# EAGLE design temperature_sensor (EAGLE 9.1.2)
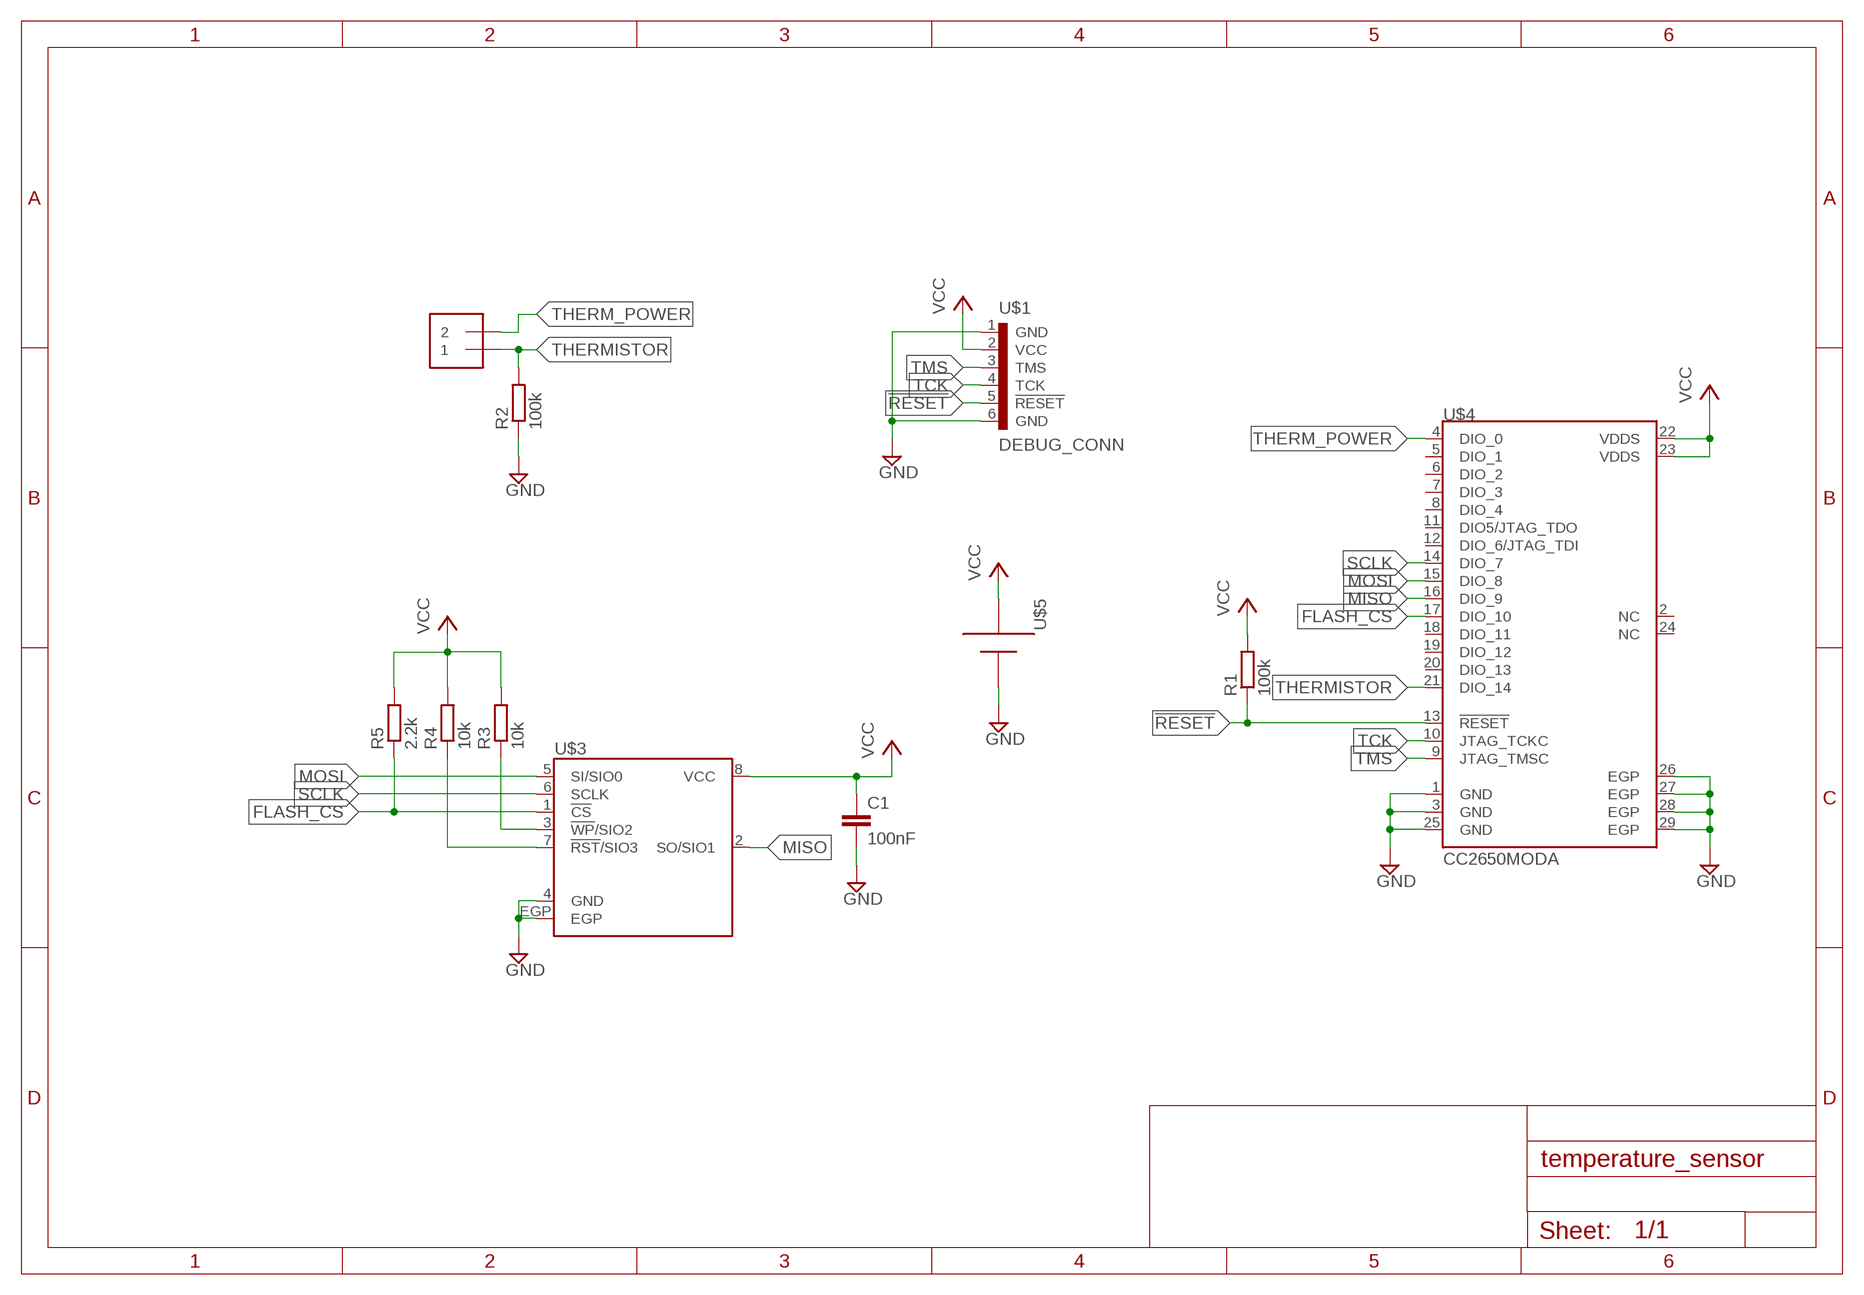
[diagram p0: schematic, sheet 1]

## Parts
C1  100nF  CAPACITOR_0402  [0402]
J2  1X2-3.5MM  [1X2-3.5MM]
R1  100k  RESISTOR_0402  [0402]
R2  100k  RESISTOR_0402  [0402]
R3  10k  RESISTOR_0402  [0402]
R4  10k  RESISTOR_0402  [0402]
R5  2.2k  RESISTOR_0402  [0402]
U$1  DEBUG_CONN  [DEBUG_CONN]
U$3  MX25R8035FMX25R8035FZUIL0  [MX25R8035FZUIL0]
U$4  CC2650MODA  [CC2650MODA]
U$5  CR2_SPRINGS  [CR2]

## Nets
!RESET: R1.1 U$1.5(!RESET) U$4.13(!RESET)
FLASH_CS: R5.1 U$3.1(!CS) U$4.17(DIO_10)
GND: C1.2 R2.1 U$1.1(GND) U$1.6(GND) U$3.4(GND) U$3.EGP U$4.1(GND) U$4.3(GND) U$4.25(GND) U$4.26(EGP) U$4.27(EGP) U$4.28(EGP) U$4.29(EGP) U$5.- U$5.-@1(-) U$5.-@2(-) U$5.-@3(-)
MISO: U$3.2(SO/SIO1) U$4.16(DIO_9)
MOSI: U$3.5(SI/SIO0) U$4.15(DIO_8)
N$1: R3.1 U$3.3(!WP!/SIO2)
N$2: R4.1 U$3.7(!RST!/SIO3)
SCLK: U$3.6(SCLK) U$4.14(DIO_7)
TCK: U$1.4(TCK) U$4.10(JTAG_TCKC)
THERM_POWER: J2.2 U$4.4(DIO_0)
THERMISTOR: J2.1 R2.2 U$4.21(DIO_14)
TMS: U$1.3(TMS) U$4.9(JTAG_TMSC)
VCC: C1.1 R1.2 R3.2 R4.2 R5.2 U$1.2(VCC) U$3.8(VCC) U$4.22(VDDS) U$4.23(VDDS) U$5.+ U$5.+@1(+) U$5.+@2(+) U$5.+@3(+)
Unconnected: U$4.2(NC) U$4.5(DIO_1) U$4.6(DIO_2) U$4.7(DIO_3) U$4.8(DIO_4) U$4.11(DIO5/JTAG_TDO) U$4.12(DIO_6/JTAG_TDI) U$4.18(DIO_11) U$4.19(DIO_12) U$4.20(DIO_13) U$4.24(NC)

## Library data of the parts
C1 = mine:CAPACITOR
J2 = adafruit:1X2: 3.5mm Terminal block http://www.ladyada.net/library/pcb/eaglelibrary.html
R1-R5 = mine:RESISTOR
U$1 = mine:DEBUG_CONN
U$3 = mine:MX25R8035F
U$4 = mine:CC2650MODA
U$5 = mine:CR2_SPRINGS

## Board
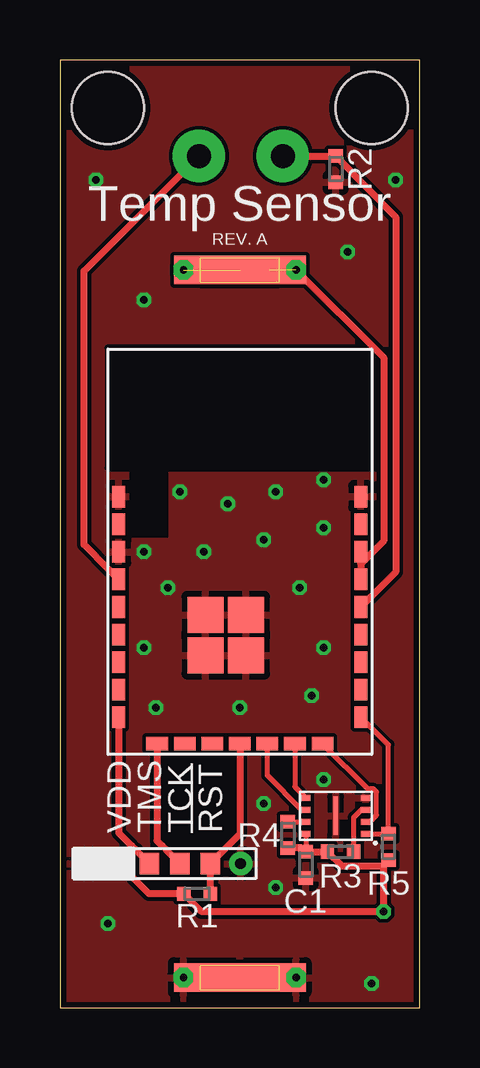
[diagram p1: board, top side]
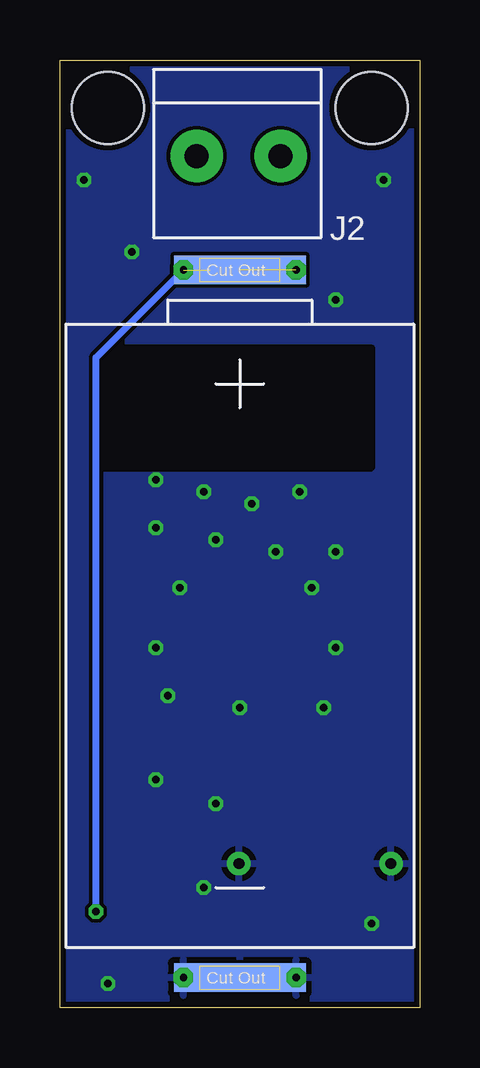
[diagram p2: board, bottom side, seen from below]

Size 15 x 39.5 mm. Coordinates in mm from the lower left corner, seen from the top.
Outline: 0,0 15,0 15,39.5 0,39.5 0,0
Copper layers (1*16): Top 0.035mm / dielectric 1.5mm / Bottom 0.035mm
Design rules "SeeedStudio_2layer_DRU_no_angle_20140221_fixed_drill_size": minimum track width 6mil, minimum drill 0.3mm, track to track 6mil, track to pad 6mil, pad to pad 6mil, via to via 6mil, smd to smd 0mil, copper to edge 10mil, drill to drill 10mil, minimum pad ring 10mil, minimum via ring 6mil, stop-mask expansion 2mil, vias tented up to drill 100mil, thermal gap 10mil
Holes 3 mm at 2,37.5 13,37.5
tRestrict: area 2,22.5 to 13,27.5
bRestrict: area 2,22.5 to 13,27.5

### Footprints (pad centres in the part's own frame; a part is rotated, then mirrored left to right if it is on the bottom)
0402 = smd 0.55 x 0.6: 1 -0.55,0; 2 0.55,0
1X2-3.5MM = drill 1 pad 2.184: 1 1.8,0; 2 -1.7,0
DEBUG_CONN = drill 0.457: 1 0,3.81; 6 0,-2.54 | smd 0.889 x 0.813: 2 0,2.54; 3 0,1.27; 4 0,0; 5 0,-1.27
MX25R8035FZUIL0 = smd 0.25 x 0.4: 1 0.75,1.25; 2 0.25,1.25; 3 -0.25,1.25; 4 -0.75,1.25; 5 -0.75,-1.25; 6 -0.25,-1.25; 7 0.25,-1.25; 8 0.75,-1.25 | smd 1.6 x 0.2: EGP 0,0
CC2650MODA = smd 0.55 x 0.9: 1 -5.05,2.3; 2 -5.05,1.15; 3 -5.05,0; 4 -5.05,-1.15; 5 -5.05,-2.3; 6 -5.05,-3.45; 7 -5.05,-4.6; 8 -5.05,-5.75; 9 -5.05,-6.9; 17 5.05,-6.9; 18 5.05,-5.75; 19 5.05,-4.6; 20 5.05,-3.45; 21 5.05,-2.3; 22 5.05,-1.15; 23 5.05,0; 24 5.05,1.15; 25 5.05,2.3 | smd 0.9 x 0.55: 10 -3.45,-8; 11 -2.3,-8; 12 -1.15,-8; 13 0,-8; 14 1.15,-8; 15 2.3,-8; 16 3.45,-8 | smd 1.5 x 1.5: 26 -1.435,-2.625; 27 -1.435,-4.325; 28 0.265,-4.325; 29 0.265,-2.625
CR2 = drill 0.3 octagon: + -2.35,14.75; +@3 2.35,14.75; - -2.35,-14.75; -@3 2.35,-14.75 | smd 5.5 x 1.2: +@1 0,14.75; -@1 0,-14.75 | smd 5.5 x 1.2 bottom: +@2 0,14.75; -@2 0,-14.75

### Placement (x,y rotation side)
C1  10.25,5.95 270 top
J2  7.5,35.5 180 bottom
R1  5.72,4.74 180 top
R2  11.5,34.95 90 top
R3  11.7,6.5 180 top
R4  9.5,7.2 270 top
R5  13.7,6.7 270 top
U$1  5,6 90 top
U$3  11.5,8 270 top
U$4  7.5,19 0 top
U$5  7.5,16 0 bottom

### Tracks (layer width: path | path; a pad name or v marks a point on that pad's centre or on a via)
!RESET
  Top 0.3: R1.1 U$1.5 7.5,7.23 U$4.13
FLASH_CS
  Top 0.2: U$3.1 R5.1 13.7,10.95 U$4.17
GND  (via drill 0.3)
  other vias: 11,9.5 1.5,34.5 12,31.5 14,34.5 2,3.5 13,1 10.5,13 4,12.5 3.5,15 4.5,17.5 3.5,19 5,21.5 6,19 7,21 8.5,19.5 11,22 7.5,12.5 11,15 3.5,29.5 9,5 8.5,8.5 10,17.5 11,20 9,21.5
  pour Top: 0,0 0,39.5 15,39.5 15,0
  pour Bottom: 0,0 0,39.5 15,39.5 15,0
MISO
  Top 0.2: U$4.16 12.82,9.13 13.05,9.13 13.2,8.98 13.2,8.02 12.93,7.75 U$3.2
MOSI
  Top 0.2: U$4.15 9.8,9.2 U$3.5
N$1
  Top 0.2: R3.1 12.25,7.93 12.57,8.25 U$3.3
N$2
  Top 0.2: R4.1 U$3.7
SCLK
  Top 0.2: U$4.14 8.65,9.67 10.07,8.25 U$3.6
TCK
  Top 0.3: U$4.10 4.05,6.95 4.25,6.75 4.26,6.75 4.44,6.57 4.44,6.56 U$1.4
THERM_POWER
  Top 0.3: J2.2 1,30.7 1,19.3 2.05,18.25 U$4.4
THERMISTOR
  Top 0.3: J2.1 R2.2 14,32.95 14,18.15 12.95,17.1 U$4.21
TMS
  Top 0.3: U$4.9 2.45,7.28 2.98,6.75 2.99,6.75 3.17,6.57 3.17,6.56 U$1.3
VCC  (via drill 0.3)  (3 unrouted)
  Top 0.2: U$3.8 C1.1
  Top 0.3: 12.55,18.5 U$4.22 | 8.75,30.75 U$5.+@2 | R4.2 10.1,6.65 C1.1 R3.2 11.75,5.9 13.45,5.9 | U$1.2 3.02,5.44 3.02,5.43 3.71,4.74 R1.2 5.91,4 9.5,4 v13.5,4 13.5,5.84 13.45,5.9 | 13.45,5.9 R5.2 | U$5.+ 13.5,27.1 13.5,19.45 12.55,18.5 | U$4.23 12.55,18.5
  Bottom 0.3: v13.5,4 13.5,27.1 U$5.+

### Text on the board
tPlace: Temp Sensor | REV. A